# Altium schematic sheet rf_top.SchDoc
size 508 x 241 mm; SheetNumber: 5; SheetTotal: 6
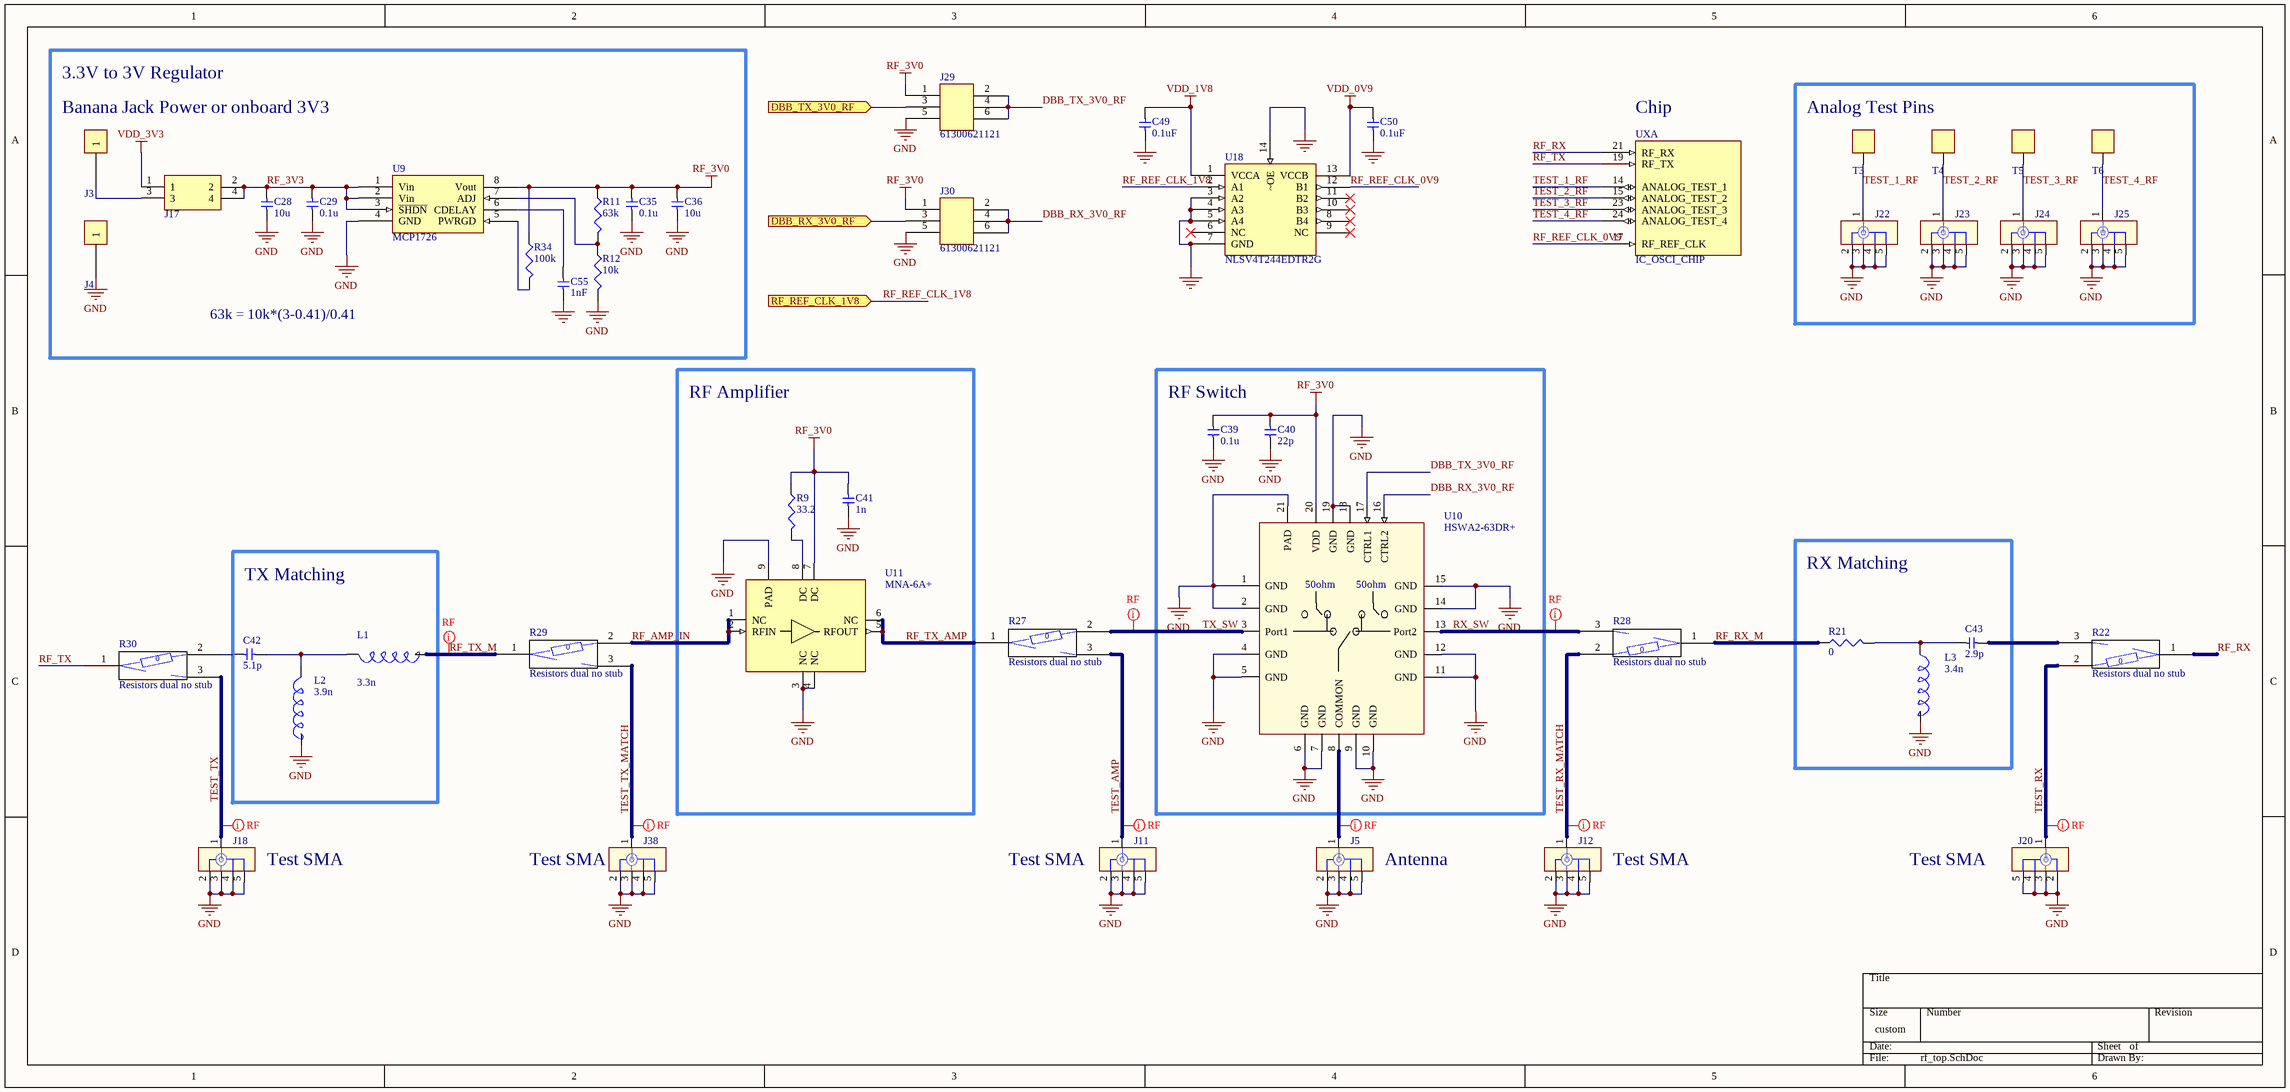
[diagram p0: rf_top.SchDoc]

## Parts
C28  10u  [0603]
C29  0.1u  [0603]
C35  0.1u  [0603]
C36  10u  [0603]
C39  0.1u  [0603]
C40  22p  [0603]
C41  1n  [0603]
C42  5.1p  [0603]
C43  2.9p  [0603]
C49  0.1uF  [0603]
C50  0.1uF  [0603]
C55  1nF  [0603]
J3  Con 1 pin  [CON-001-312X312/BANANA-JACK]  (value not drawn)
J4  Con 1 pin  [CON-001-312X312/BANANA-JACK]  (value not drawn)
J5  Con RF SMA  [CON-001-7.0X7.0/ALL-THT-SMA-ST]  (value not drawn)
J11  Con RF SMA  [CON-001-7.0X7.0/ALL-THT-SMA-ST]  (value not drawn)
J12  Con RF SMA  [CON-001-7.0X7.0/ALL-THT-SMA-ST]  (value not drawn)
J17  Con 4 pins 2x2  [CON-004-100-200X200/2X2-POST]  (value not drawn)
J18  Con RF SMA  [CON-001-7.0X7.0/ALL-THT-SMA-ST]  (value not drawn)
J20  Con RF SMA  [CON-001-7.0X7.0/ALL-THT-SMA-ST]  (value not drawn)
J22  Con RF SMA  [CON-001-7.0X7.0/ALL-THT-SMA-ST]  (value not drawn)
J23  Con RF SMA  [CON-001-7.0X7.0/ALL-THT-SMA-ST]  (value not drawn)
J24  Con RF SMA  [CON-001-7.0X7.0/ALL-THT-SMA-ST]  (value not drawn)
J25  Con RF SMA  [CON-001-7.0X7.0/ALL-THT-SMA-ST]  (value not drawn)
J29  61300621121  [CON-006-100-300X200/2X3-POST]
J30  61300621121  [CON-006-100-300X200/2X3-POST]
J38  Con RF SMA  [CON-001-7.0X7.0/ALL-THT-SMA-ST]  (value not drawn)
L1  3.3n  [0603]
L2  3.9n  [0603]
L3  3.4n  [0603]
R9  33.2  [0603]
R11  63k  [0603]
R12  10k  [0603]
R21  0  [0603]
R22  Resistors dual no stub  [1206-DUAL-NOSTUB-FLIP2]  (no BOM)
R27  Resistors dual no stub  [1206-DUAL-NOSTUB-FLIP]  (no BOM)
R28  Resistors dual no stub  [1206-DUAL-NOSTUB-FLIP2]  (no BOM)
R29  Resistors dual no stub  [1206-DUAL-NOSTUB-FLIP]  (no BOM)
R30  Resistors dual no stub  [1206-DUAL-NOSTUB-FLIP]  (no BOM)
R34  100k  [0603]
T3  Test point 1 pin  [TP-100X100/ROUND-THT]  (value not drawn)
T4  Test point 1 pin  [TP-100X100/ROUND-THT]  (value not drawn)
T5  Test point 1 pin  [TP-100X100/ROUND-THT]  (value not drawn)
T6  Test point 1 pin  [TP-100X100/ROUND-THT]  (value not drawn)
U9  MCP1726  [SOIC-8]
U10  HSWA2-63DR+  [QFN-20-.5-4.0X4.0]
U11  MNA-6A+  [QFN-08-.65-3.0X3.0]
U18  NLSV4T244EDTR2G  [TSSOP-14]
UX  IC_OSCI_CHIP  [QFN-48-.4-6.0X6.0-LP]  (part A of 4)

## Blocks framed on the sheet
Analog Test Pins: J22-J25 T3-T6
RF Amplifier: C41 R9 U11
RF Switch: C39 C40 U10
TX Matching: C42 L1 L2
RX Matching: C43 L3 R21

## Ports
DBB_RX_3V0_RF (in), DBB_TX_3V0_RF (in), RF_REF_CLK_1V8 (in)

## Nets
GND: C28.2 C29.2 C35.2 C36.2 C39.2 C40.2 C41.2 C49.2 C50.2 C55.2 J4.1 J5.2 J5.3 J5.4 J5.5 J11.2 J11.3 J11.4 J11.5 J12.2 J12.3 J12.4 J12.5 J18.2 J18.3 J18.4 J18.5 J20.2 J20.3 J20.4 J20.5 J22.2 J22.3 J22.4 J22.5 J23.2 J23.3 J23.4 J23.5 J24.2 J24.3 J24.4 J24.5 J25.2 J25.3 J25.4 J25.5 J29.5 J30.5 J38.2 J38.3 J38.4 J38.5 L2.1 L3.1 R12.2 U9.4(GND) U10.1(GND) U10.2(GND) U10.4(GND) U10.5(GND) U10.6(GND) U10.7(GND) U10.9(GND) U10.10(GND) U10.11(GND) U10.12(GND) U10.14(GND) U10.15(GND) U10.18(GND) U10.19(GND) U10.21(PAD) U11.3(NC) U11.4(NC) U11.9(PAD) U18.3(A2) U18.4(A3) U18.5(A4) U18.7(GND) U18.14(~OE)
RF_3V0: C35.1 C36.1 C39.1 C40.1 C41.1 J29.1 J30.1 R9.1 R11.1 R34.1 U9.8(Vout) U10.20(VDD) U11.7(DC)
VDD_0V9: C50.1 U18.13(VCCB)
VDD_1V8: C49.1 U18.1(VCCA)
VDD_3V3: J17.1
DBB_RX_3V0_RF: J30.2 J30.4 J30.6 U10.16(CTRL2)
DBB_RX_3V0_RF: J30.3 ; port DBB_RX_3V0_RF  [a separate net that carries the same name]
DBB_TX_3V0_RF: J29.2 J29.4 J29.6 U10.17(CTRL1)
DBB_TX_3V0_RF: J29.3 ; port DBB_TX_3V0_RF  [a separate net that carries the same name]
RF_3V3: C28.1 C29.1 J17.2 J17.4 U9.1(Vin) U9.2(Vin) U9.3(~{SHDN})
RF_AMP_IN: R29.2 U11.1(NC) U11.2(RFIN)
RF_REF_CLK_0V9: U18.12(B1) UX.17(RF_REF_CLK)
RF_REF_CLK_1V8: U18.2(A1) ; port RF_REF_CLK_1V8
RF_RX: R22.1 UX.21(RF_RX)
RF_RX_M: R21.2 R28.1
RF_TX: R30.1 UX.19(RF_TX)
RF_TX_AMP: R27.1 U11.5(RFOUT) U11.6(NC)
RF_TX_M: L1.1 R29.1
RX_SW: R28.3 U10.13(Port2)
TEST_1_RF: J22.1 T3.1 UX.14(ANALOG_TEST_1)
TEST_2_RF: J23.1 T4.1 UX.15(ANALOG_TEST_2)
TEST_3_RF: J24.1 T5.1 UX.23(ANALOG_TEST_3)
TEST_4_RF: J25.1 T6.1 UX.24(ANALOG_TEST_4)
TEST_AMP: J11.1 R27.3
TEST_RX: J20.1 R22.2
TEST_RX_MATCH: J12.1 R28.2
TEST_TX: J18.1 R30.3
TEST_TX_MATCH: J38.1 R29.3
TX_SW: R27.2 U10.3(Port1)
NetC42_1: C42.1 R30.2
NetC42_2: C42.2 L1.2 L2.2
NetC43_1: C43.1 R22.3
NetC43_2: C43.2 L3.2 R21.1
NetC55_1: C55.1 U9.6(CDELAY)
NetJ3_1: J3.1 J17.3
NetJ5_1: J5.1 U10.8(COMMON)
NetR9_2: R9.2 U11.8(DC)
NetR11_2: R11.2 R12.1 U9.7(ADJ)
NetR34_2: R34.2 U9.5(PWRGD)

Not connected (* = marked no-connect by the designer): U18 6(NC)* 8(B4)* 9(NC)* 10(B3)* 11(B2)*

## Layout directives
net class RF: NetJ5_1, RF_TX_M, RX_SW, TEST_AMP, TEST_RX, TEST_RX_MATCH, TEST_TX, TEST_TX_MATCH, TX_SW

## Notes on the sheet
- 3.3V to 3V Regulator
- (near J3) Banana Jack Power or onboard 3V3
- (near UX) Chip
- 63k = 10k*(3-0.41)/0.41
- (near J18) Test SMA
- (near J38) Test SMA
- (near J11) Test SMA
- (near J5) Antenna
- (near J12) Test SMA
- (near J20) Test SMA
- (in symbol DISCRETE_R_DUAL) 0
- (in symbol IC_HSWA2-63DR+) 50ohm

## Library data of the parts
C28 C29 C35 C36 C39-C43 = DISCRETE_C: Capacitor generic
C49 C50 C55 = DISCRETE_C: 0.1uF 0402
J3 J4 = CON_001pin_1x1
J5 J11 J12 J18 J20 J22-J25 J38 = CON_RF_SMA
J17 = CON_004pin_2x2
L1-L3 = DISCRETE_L: Inductor generic
R9 R11 R12 R21 = DISCRETE_R: Resistor generic
R22 R27-R30 = DISCRETE_R_DUAL
R34 = DISCRETE_R: 200 0402
T3-T6 = TEST_PT
U9 = MCP1726: 1A, Low-Voltage, Low Quiescent Current LDO Regulator
U10 = IC_HSWA2-63DR+: HSWA2-63DR+ RF T/R switch
U11 = IC_MNA-6A+: MNA-6A+ RF power amplifier
U18 = NLSV4T244EDTR2G: Non-Inverting Level / Translator, Dual-Supply, / 4-Bit
UX = IC_OSCI_CHIP: EE290C Tapeout Class IC